# Altium schematic sheet Air_SCHv3.SchDoc
size A
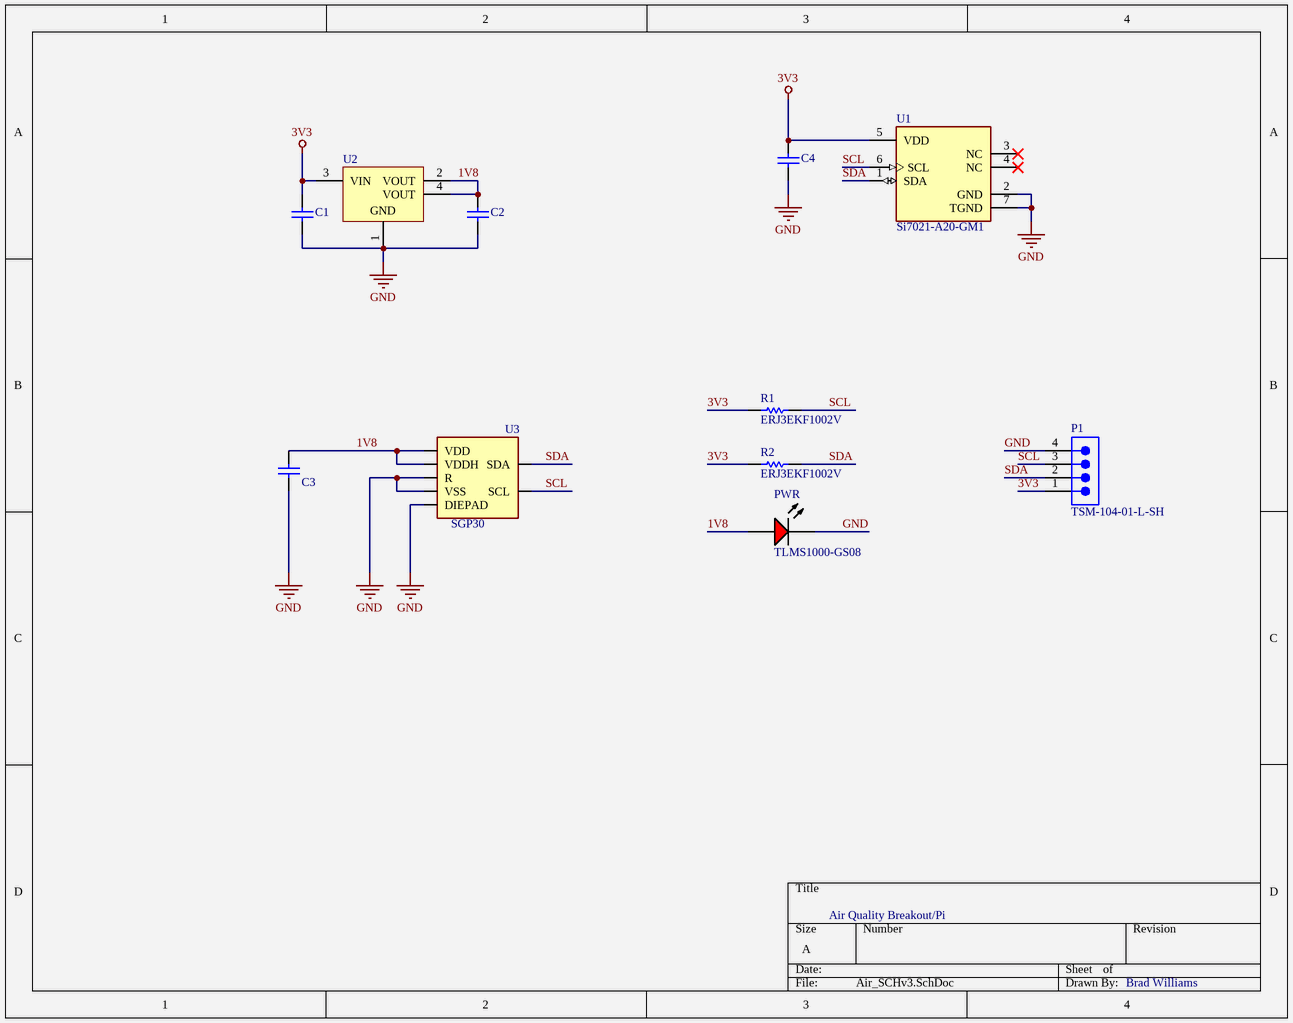
[diagram p0: Air_SCHv3.SchDoc]

## Parts
C1  CGA3E2X7R1H104K080AA  [CAPC1608X90X20LL10]  (value not drawn)
C2  GCM21BR70J106KE22L  [CAPC2013X140X45LL15T25]  (value not drawn)
C3  CGA3E2X7R1H104K080AA  [CAPC1608X90X20LL10]  (value not drawn)
C4  CGA3E2X7R1H104K080AA  [CAPC1608X90X20LL10]  (value not drawn)
P1  TSM-104-01-L-SH  [SMTC-TSM-104-01-X-SH]
PWR  TLMS1000-GS08  [VISH-TLMS1000_V]
R1  ERJ3EKF1002V  [RESC1609X55X30LL15T15]
R2  ERJ3EKF1002V  [RESC1609X55X30LL15T15]
U1  Si7021-A20-GM1  [FP-Si7021-A20-GM1-MFG]
U2  LD1117AS18TR  [SOT-223_L]  (value not drawn)
U3  SGP30  [SGP30]

## Nets
3V3: C1.2 C4.2 P1.1 R1.1 R2.1 U1.5(VDD) U2.3(VIN)
GND: C1.1 C2.1 C3.1 C4.1 P1.4 PWR.2(K) U1.2(GND) U1.7(TGND) U2.1(GND) U3.2(VSS) U3.4(R) U3.DIEPAD
1V8: C2.2 C3.2 PWR.1(A) U2.2(VOUT) U2.4(VOUT) U3.1(VDD) U3.5(VDDH)
SCL: P1.3 R1.2 U1.6(SCL) U3.6(SCL)
SDA: P1.2 R2.2 U1.1(SDA) U3.3(SDA)

Not connected (* = marked no-connect by the designer): U1 3(NC)* 4(NC)*

## Notes on the sheet
- Air Quality Breakout/Pi
- Brad Williams

## Library data of the parts
C1 C3 C4 = CMP-2000-07546-1: Chip Capacitor, 0.1 uF, +/- 10%, 50 V, -55 to 125 degC, 0603 (1608 Metric), RoHS, Tape and Reel; Manufacturer: TDK; Capacitance: 100nF; Voltage: 50V; Dielectric: X7R; Package Reference: 603; Radiation Hardening: No; Composition: Ceramic; Datasheet URL: https://product.tdk.com/info/en/catalog/datasheets/mlcc_automotive_general_en.pdf; Mounting Technology: SurfaceMount; Datasheet Version: 12/2014; Width: 0.8mm; Length: 1.6mm; Tolerance: 10%; Case Code (Imperial): 0603; RoHSCompliant: True; Min Operating Temperature: -55degC; Package Description: 2-Pin Surface Mount Device, Body 1.6 x 0.8 mm; Packaging: TapeandReel; Package Quantity: 1; Voltage Rating: 50V; Mount: SurfaceMount; Lead Free: LeadFree; Depth: 0.8mm; Termination: SMD/SMT; Case Code (Metric): 1608; Thickness: 0.035inch; Height: 0.8mm; Weight: 7.1E-05oz; Voltage Rating (DC): 50V; REACH SVHC: NoSVHC; Manufacturer URL: http://www.tdk.com/; Case/Package: 0603; Max Operating Temperature: 125degC
C2 = CMP-2007-03335-1: Manufacturer: Murata; Part Number: GCM21BR70J106KE22L
P1 = CMP-1024-00225-1: 0.025" SQ Post Header, Surface Mount, Horizontal, -55 to 125 degC, 2.54 mm Pitch, 4-Pin, Male, RoHS; Manufacturer: Samtec; Pitch: 2.54 mm; Orientation: Horizontal; DatasheetVersion: F-214; PackageVersion: CD, 7/1991; Temperature Range: -55 to 125 degC; ComponentLink2URL: http://www.samtec.com/documents/webfiles/pdf/TSM.PDF; ComponentLink3URL: http://www.samtec.com/documents/webfiles/cpdf/TSM-1XX-XX-XXX-SH-XX-XXX-XX-MKT1.pdf; PartNumber: TSM-104-01-L-SH; ComponentLink2Description: Datasheet; ComponentLink3Description: Package Specification; PackageReference: TSM-104-01-X-SH; PackageDescription: Terminal Strip Single Surface Mount; ComponentLink1Description: Manufacturer URL; RoHS: True; Mounting Technology: Surface Mount; ComponentLink1URL: http://www.samtec.com
PWR = CMP-2000-07254-1: Low Current LED, 40 mW, 1.8 V, -40 to 100 degC, 2-Pin SMD (0603), RoHS, Tape and Reel; Manufacturer: Vishay; Lens Shape: Rectangular; Automotive Qualification Standard: AEC-Q100; Wavelength Typ: 636nm; SVHC: ToBeAdvised; LED Colour: Red; Bulb Size: 1.6mmx0.8mm; Forward Voltage: 1.8V; Luminous Intensity: 4mcd; Forward Current If: 2mA; Viewing Angle: 80°; Datasheet Version: Rev. 1.7, 02/2011; Datasheet URL: https://datasheet.ciiva.com/5798/1698881-5798337.pdf; LED Mounting: SMD; Packaging: CutTape; Package Reference: TLMS1000; Manufacturer URL: http://www.vishay.com/; Mounting Technology: SurfaceMount; Product Range: -; Package Description: 2-Pin Surface Mount Device, Body 1.6 x 0.8 mm; MSL: MSL2-1year
R1 R2 = CMP-2000-07452-1: Chip Resistor, 10 KOhm, +/- 1%, 0.1 W, -55 to 155 degC, 0603 (1608 Metric), RoHS, Tape and Reel; Manufacturer: Panasonic; Voltage Rating: 75V; Case\/Package: 0603; Power Rating: 100mW; Resistance: 10KOhm; Temperature Coefficient: 100ppm\/degreesC; Number of Pins: 2; Package Reference: 603; Depth: 0.8mm; Mount: SurfaceMount; Package Description: 2-Pin Surface Mount Device, Body 1.6 x 0.85 mm; Datasheet Version: 02/2017; Length: 1.6mm; Lead Free: LeadFree; Height: 0.45mm; Number of Terminations: 2; Max Power Dissipation: 100mW; Min Operating Temperature: -55degC; Datasheet URL: https://industrial.panasonic.com/cdbs/www-data/pdf/RDA0000/AOA0000C304.pdf; Termination: SMD/SMT; Case Code (Metric): 1608; Case Code (Imperial): 0603; Tolerance: 1%; Max Operating Temperature: 155degC; RoHSCompliant: true; Voltage Rating (DC): 75V; Radiation Hardening: No; Packaging: TapeandReel; Composition: ThickFilm; Mounting Technology: SurfaceMount; Manufacturer URL: http://www.panasonic.com/; Width: 0.031inch; REACH SVHC: NoSVHC; Contact Plating: Tin; Military Standard: Not; Package Quantity: 1
U1 = CMP-08164-000006-1: SENS HUMI/TEMP 3.6V I2C 3% 6DFN; Min Supply Voltage: 1.9V; Response Time: 18s; Sensor Type: Temperature; Case/Package: DFN; Number of Pins: 6; Height: 0.75mm; Interface: I2C; Accuracy: 3%; Max Operating Temperature: 85°C; Width: 3mm; Min Operating Temperature: -40°C; Length: 3mm; Output Type: I2C; Mount: Surface Mount; Max Supply Voltage: 3.6V
U2 = CMP-0244-00319-1: 1A, Low Drop Positive Voltage Regulator, 1.8V, 4-Pin SOT-223, Tape and Reel; DatasheetVersion: 2/12/2011; ComponentLink2URL: http://www.st.com/internet/com/TECHNICAL_RESOURCES/TECHNICAL_LITERATURE/DATASHEET/CD00002116.pdf; ComponentLink1Description: Manufacturer URL; ComponentLink1URL: http://www.st.com; PackageReference: SOT-223; PackageVersion: 2010; PackageDescription: 4-Pin SOT-223 Package, 6.5 x 3.5 mm Body, 2.3 mm Pitch, 7 mm Lead Span; ComponentLink2Description: Datasheet
U3 = CMP-011-0000-1: AIR QUALITY GAS SENSOR FOR VOC'S; MF: Sensirion AG; Package: None; SnapEDA_Link: https://www.snapeda.com/parts/SGP30/Sensirion%20AG/view-part/1413307/?ref=snap; Component Type: Standard; Pin Count: 7; Design Item ID: SGP30; MP: SGP30; Price: None; Source: SnapEDAsch.SchLib; Availability: Unavailable; Value: *